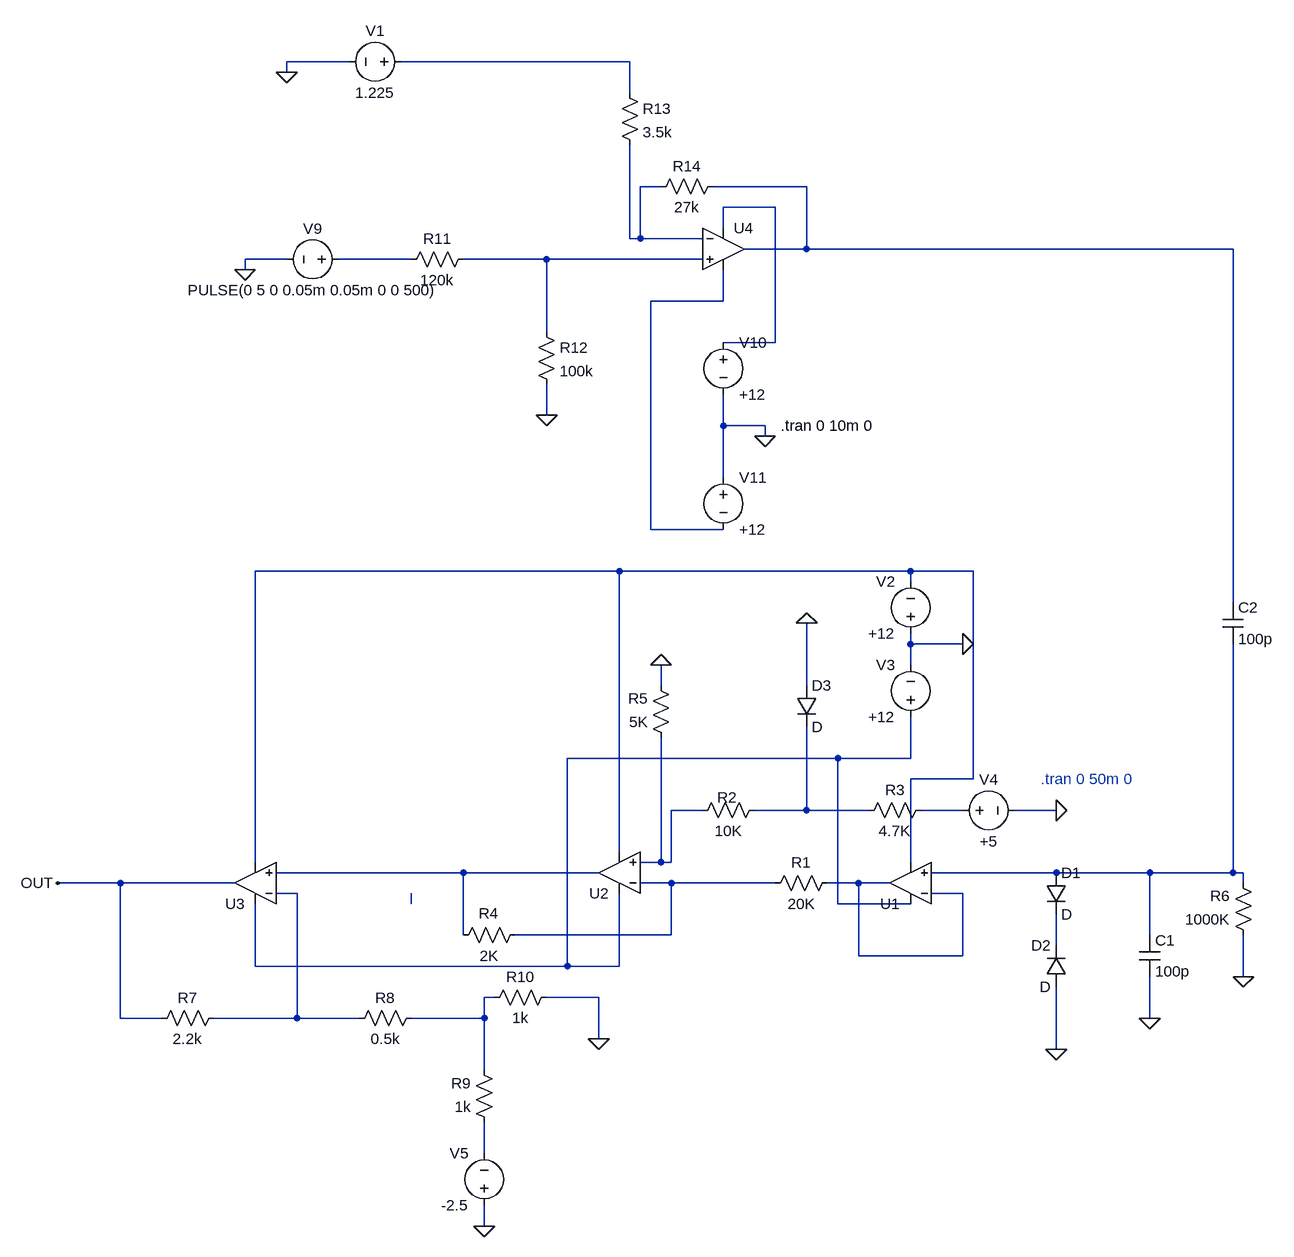
[diagram p0: schematic final_circuit.asc]
final_circuit.asc, the LTspice schematic file:
Version 4
SHEET 1 2472 708
WIRE -576 -1104 -672 -1104
WIRE -144 -1104 -496 -1104
WIRE -672 -1088 -672 -1104
WIRE -144 -1056 -144 -1104
WIRE -96 -912 -128 -912
WIRE 128 -912 -16 -912
WIRE 80 -880 0 -880
WIRE 0 -848 0 -880
WIRE -144 -832 -144 -976
WIRE -128 -832 -128 -912
WIRE -128 -832 -144 -832
WIRE -32 -832 -128 -832
WIRE 128 -816 128 -912
WIRE 128 -816 32 -816
WIRE 784 -816 128 -816
WIRE -672 -800 -736 -800
WIRE -480 -800 -592 -800
WIRE -272 -800 -400 -800
WIRE -32 -800 -272 -800
WIRE -736 -784 -736 -800
WIRE 0 -736 0 -784
WIRE 0 -736 -112 -736
WIRE -272 -688 -272 -800
WIRE 80 -672 80 -880
WIRE 80 -672 0 -672
WIRE -272 -560 -272 -608
WIRE 0 -544 0 -592
WIRE 64 -544 0 -544
WIRE 64 -528 64 -544
WIRE 0 -464 0 -544
WIRE -112 -384 -112 -736
WIRE 0 -384 -112 -384
WIRE -160 -320 -720 -320
WIRE 288 -320 -160 -320
WIRE 384 -320 288 -320
WIRE 288 -304 288 -320
WIRE 784 -272 784 -816
WIRE 288 -208 288 -224
WIRE 368 -208 288 -208
WIRE 288 -176 288 -208
WIRE -96 -144 -96 -176
WIRE 128 -144 128 -240
WIRE 176 -32 -240 -32
WIRE 288 -32 288 -96
WIRE 288 -32 176 -32
WIRE 384 0 384 -320
WIRE 384 0 288 0
WIRE -32 48 -80 48
WIRE 128 48 128 -80
WIRE 128 48 48 48
WIRE 224 48 128 48
WIRE 368 48 304 48
WIRE 512 48 448 48
WIRE -160 112 -160 -320
WIRE -720 128 -720 -320
WIRE -96 128 -96 -64
WIRE -96 128 -128 128
WIRE -80 128 -80 48
WIRE -80 128 -96 128
WIRE 288 128 288 0
WIRE -400 144 -688 144
WIRE -192 144 -400 144
WIRE 512 144 320 144
WIRE 656 144 512 144
WIRE 784 144 784 -208
WIRE 784 144 656 144
WIRE 800 144 784 144
WIRE -928 160 -1024 160
WIRE -752 160 -928 160
WIRE -80 160 -128 160
WIRE 80 160 -80 160
WIRE 208 160 160 160
WIRE 256 160 208 160
WIRE 800 160 800 144
WIRE -656 176 -688 176
WIRE 368 176 320 176
WIRE -480 192 -480 176
WIRE 176 192 176 -32
WIRE 288 192 176 192
WIRE -400 240 -400 144
WIRE -80 240 -80 160
WIRE -80 240 -320 240
WIRE 656 240 656 144
WIRE 512 256 512 208
WIRE 208 272 208 160
WIRE 368 272 368 176
WIRE 368 272 208 272
WIRE -720 288 -720 192
WIRE -240 288 -240 -32
WIRE -240 288 -720 288
WIRE -160 288 -160 176
WIRE -160 288 -240 288
WIRE 800 304 800 240
WIRE -352 336 -368 336
WIRE -192 336 -272 336
WIRE -928 368 -928 160
WIRE -864 368 -928 368
WIRE -656 368 -656 176
WIRE -656 368 -784 368
WIRE -560 368 -656 368
WIRE -368 368 -368 336
WIRE -368 368 -480 368
WIRE 656 368 656 304
WIRE -192 400 -192 336
WIRE 512 416 512 320
WIRE -368 448 -368 368
WIRE -368 576 -368 528
WIRE -368 688 -368 656
FLAG -96 -176 0
FLAG 512 416 0
FLAG 800 304 0
FLAG 656 368 0
FLAG 128 -240 0
FLAG 512 48 0
FLAG 368 -208 0
FLAG -272 -560 0
FLAG -672 -1088 0
FLAG 64 -528 0
FLAG -736 -784 0
FLAG -1024 160 OUT
FLAG -192 400 0
FLAG -368 688 0
SYMBOL OpAmps\\UniversalOpAmp1 288 160 R180
SYMATTR InstName U1
SYMBOL res 176 144 R90
WINDOW 0 0 56 VBottom 2
WINDOW 3 32 56 VTop 2
SYMATTR InstName R1
SYMATTR Value 20K
SYMBOL res 64 32 R90
WINDOW 0 12 58 VBottom 2
WINDOW 3 32 56 VTop 2
SYMATTR InstName R2
SYMATTR Value 10K
SYMBOL res 320 32 R90
WINDOW 0 0 56 VBottom 2
WINDOW 3 32 56 VTop 2
SYMATTR InstName R3
SYMATTR Value 4.7K
SYMBOL res -304 224 R90
WINDOW 0 -2 57 VBottom 2
WINDOW 3 32 56 VTop 2
SYMATTR InstName R4
SYMATTR Value 2K
SYMBOL res -80 -48 R180
WINDOW 0 36 76 Left 2
WINDOW 3 36 40 Left 2
SYMATTR InstName R5
SYMATTR Value 5K
SYMBOL res 816 256 R180
WINDOW 0 36 76 Left 2
WINDOW 3 36 40 Left 2
SYMATTR InstName R6
SYMATTR Value 1000K
SYMBOL OpAmps\\UniversalOpAmp1 -160 144 R180
SYMATTR InstName U2
SYMBOL diode 496 144 R0
SYMATTR InstName D1
SYMBOL diode 528 320 R180
WINDOW 0 24 64 Left 2
WINDOW 3 24 0 Left 2
SYMATTR InstName D2
SYMBOL diode 112 -144 R0
SYMATTR InstName D3
SYMBOL cap 640 240 R0
SYMATTR InstName C1
SYMATTR Value 100p
SYMBOL voltage 288 -208 R180
WINDOW 0 24 96 Left 2
WINDOW 3 24 16 Left 2
WINDOW 123 0 0 Left 0
WINDOW 39 0 0 Left 0
SYMATTR InstName V2
SYMATTR Value +12
SYMBOL voltage 288 -80 R180
WINDOW 0 24 96 Left 2
WINDOW 3 24 16 Left 2
WINDOW 123 0 0 Left 0
WINDOW 39 0 0 Left 0
SYMATTR InstName V3
SYMATTR Value +12
SYMBOL voltage 352 48 R270
WINDOW 0 32 56 VTop 2
WINDOW 3 -32 56 VBottom 2
WINDOW 123 0 0 Left 0
WINDOW 39 0 0 Left 0
SYMATTR InstName V4
SYMATTR Value +5
SYMBOL cap 768 -272 R0
SYMATTR InstName C2
SYMATTR Value 100p
SYMBOL OpAmps\\UniversalOpAmp1 0 -816 R0
SYMATTR InstName U4
SYMBOL res -384 -816 R90
WINDOW 0 0 56 VBottom 2
WINDOW 3 32 56 VTop 2
SYMATTR InstName R11
SYMATTR Value 120k
SYMBOL voltage -576 -800 R90
WINDOW 0 -32 56 VBottom 2
WINDOW 3 32 56 VTop 2
WINDOW 123 0 0 Left 0
WINDOW 39 0 0 Left 0
SYMATTR InstName V9
SYMATTR Value PULSE(0 5 0 0.05m 0.05m 0 0 500)
SYMBOL res -288 -704 R0
SYMATTR InstName R12
SYMATTR Value 100k
SYMBOL res -160 -1072 R0
SYMATTR InstName R13
SYMATTR Value 3.5k
SYMBOL res 0 -928 R90
WINDOW 0 0 56 VBottom 2
WINDOW 3 32 56 VTop 2
SYMATTR InstName R14
SYMATTR Value 27k
SYMBOL voltage -480 -1104 R90
WINDOW 0 -32 56 VBottom 2
WINDOW 3 32 56 VTop 2
WINDOW 123 0 0 Left 0
WINDOW 39 0 0 Left 0
SYMATTR InstName V1
SYMATTR Value 1.225
SYMBOL voltage 0 -688 R0
WINDOW 123 0 0 Left 0
WINDOW 39 0 0 Left 0
SYMATTR InstName V10
SYMATTR Value +12
SYMBOL voltage 0 -480 R0
WINDOW 123 0 0 Left 0
WINDOW 39 0 0 Left 0
SYMATTR InstName V11
SYMATTR Value +12
SYMBOL OpAmps\\UniversalOpAmp -720 160 R180
SYMATTR InstName U3
SYMBOL res -768 352 R90
WINDOW 0 0 56 VBottom 2
WINDOW 3 32 56 VTop 2
SYMATTR InstName R7
SYMATTR Value 2.2k
SYMBOL res -352 544 R180
WINDOW 0 36 76 Left 2
WINDOW 3 36 40 Left 2
SYMATTR InstName R9
SYMATTR Value 1k
SYMBOL res -368 352 R270
WINDOW 0 32 56 VTop 2
WINDOW 3 0 56 VBottom 2
SYMATTR InstName R10
SYMATTR Value 1k
SYMBOL res -464 352 R90
WINDOW 0 0 56 VBottom 2
WINDOW 3 32 56 VTop 2
SYMATTR InstName R8
SYMATTR Value 0.5k
SYMBOL voltage -368 672 R180
WINDOW 0 24 96 Left 2
WINDOW 3 24 16 Left 2
WINDOW 123 0 0 Left 0
WINDOW 39 0 0 Left 0
SYMATTR InstName V5
SYMATTR Value -2.5
TEXT 488 0 Left 2 ;.tran 0 50m 0
TEXT 88 -544 Left 2 !.tran 0 10m 0

The netlist it stands for:
* final_circuit.asc
XU1 N014 N016 N009 N008 N016 level1 Avol=1Meg GBW=10Meg Vos=0 En=0 Enk=0 In=0 Ink=0 Rin=500Meg  ; pins In+ In- V+ V- OUT
R1 N016 N015 20K
R2 N011 N010 10K
R3 N012 N011 4.7K
R4 N015 N013 2K
R5 N010 0 5K
R6 0 N014 1000K
XU2 N010 N015 N009 N008 N013 level1 Avol=1Meg GBW=10Meg Vos=0 En=0 Enk=0 In=0 Ink=0 Rin=500Meg  ; pins In+ In- V+ V- OUT
D1 N014 N019 D
D2 0 N019 D
D3 0 N011 D
C1 N014 0 100p
V2 0 N008 +12
V3 N009 0 +12
V4 N012 0 +5
C2 N003 N014 100p
XU4 N006 N002 N004 N007 N003 level1 Avol=1Meg GBW=10Meg Vos=0 En=0 Enk=0 In=0 Ink=0 Rin=500Meg  ; pins In+ In- V+ V- OUT
R11 N006 N005 120k
V9 N005 0 PULSE(0 5 0 0.05m 0.05m 0 0 500)
R12 N006 0 100k
R13 N001 N002 3.5k
R14 N003 N002 27k
V1 N001 0 1.225
V10 N004 0 +12
V11 0 N007 +12
XU3 N013 N017 N009 N008 OUT level1 Avol=1Meg GBW=10Meg Vos=0 En=0 Enk=0 In=0 Ink=0 Rin=500Meg  ; pins In+ In- V+ V- OUT
R7 N017 OUT 2.2k
R9 N021 N020 1k
R10 N020 0 1k
R8 N020 N017 0.5k
V5 0 N021 -2.5
.model D D
.lib standard.dio
* .tran 0 50m 0
.tran 0 10m 0
.lib UniversalOpAmp1.lib
.backanno
.end